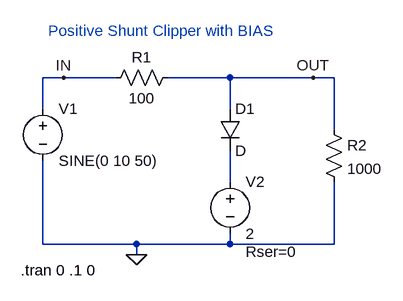
[diagram p0: schematic Draft3.asc]
Draft3.asc, the LTspice schematic file:
Version 4
SHEET 1 880 680
WIRE 32 80 0 80
WIRE 112 80 32 80
WIRE 288 80 192 80
WIRE 416 80 288 80
WIRE 448 80 416 80
WIRE 0 128 0 80
WIRE 288 128 288 80
WIRE 448 160 448 80
WIRE 288 240 288 192
WIRE 0 336 0 208
WIRE 144 336 0 336
WIRE 288 336 288 320
WIRE 288 336 144 336
WIRE 448 336 448 240
WIRE 448 336 288 336
WIRE 144 352 144 336
FLAG 144 352 0
FLAG 32 80 IN
FLAG 416 80 OUT
SYMBOL diode 272 128 R0
SYMATTR InstName D1
SYMBOL voltage 0 112 R0
WINDOW 123 0 0 Left 0
WINDOW 39 0 0 Left 0
SYMATTR InstName V1
SYMATTR Value SINE(0 10 50)
SYMBOL voltage 288 224 R0
WINDOW 123 0 0 Left 0
WINDOW 39 24 124 Left 2
SYMATTR InstName V2
SYMATTR Value 2
SYMATTR SpiceLine Rser=0
SYMBOL res 96 96 R270
WINDOW 0 32 56 VTop 2
WINDOW 3 0 56 VBottom 2
SYMATTR InstName R1
SYMATTR Value 100
SYMBOL res 432 144 R0
SYMATTR InstName R2
SYMATTR Value 1000
TEXT -34 376 Left 2 !.tran 0 .1 0
TEXT 8 8 Left 2 ;Positive Shunt Clipper with BIAS

The netlist it stands for:
* Draft3.asc
D1 OUT N001 D
V1 IN 0 SINE(0 10 50)
V2 N001 0 2 Rser=0
R1 IN OUT 100
R2 OUT 0 1000
.model D D
.lib standard.dio
.tran 0 .1 0
* Positive Shunt Clipper with BIAS
.backanno
.end

* Results of the author's LTspice run, read from the files saved beside the schematic
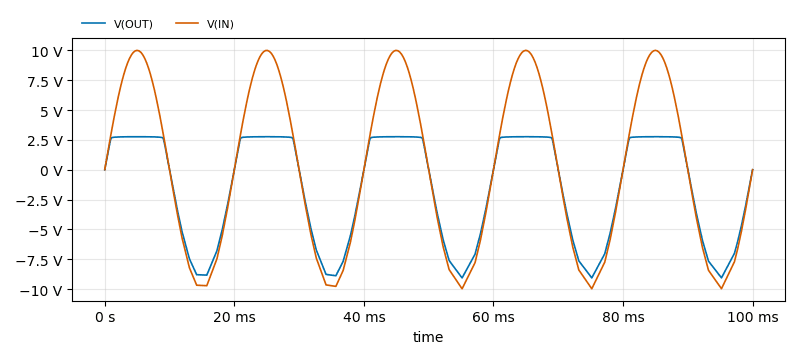
[diagram p1: Transient Analysis of Draft3.asc, plotted from the saved traces]
* Transient Analysis, 1 run:
*   V(OUT): min -9.069 V, max 2.765 V, average -1.6 V, rms 4.829 V, last 0 V
*   V(IN): min -9.979 V, max 10 V, average 56.39 mV, rms 7.017 V, last 0 V